# EAGLE schematic AAA_third_source_with charger (EAGLE 7.2.0)
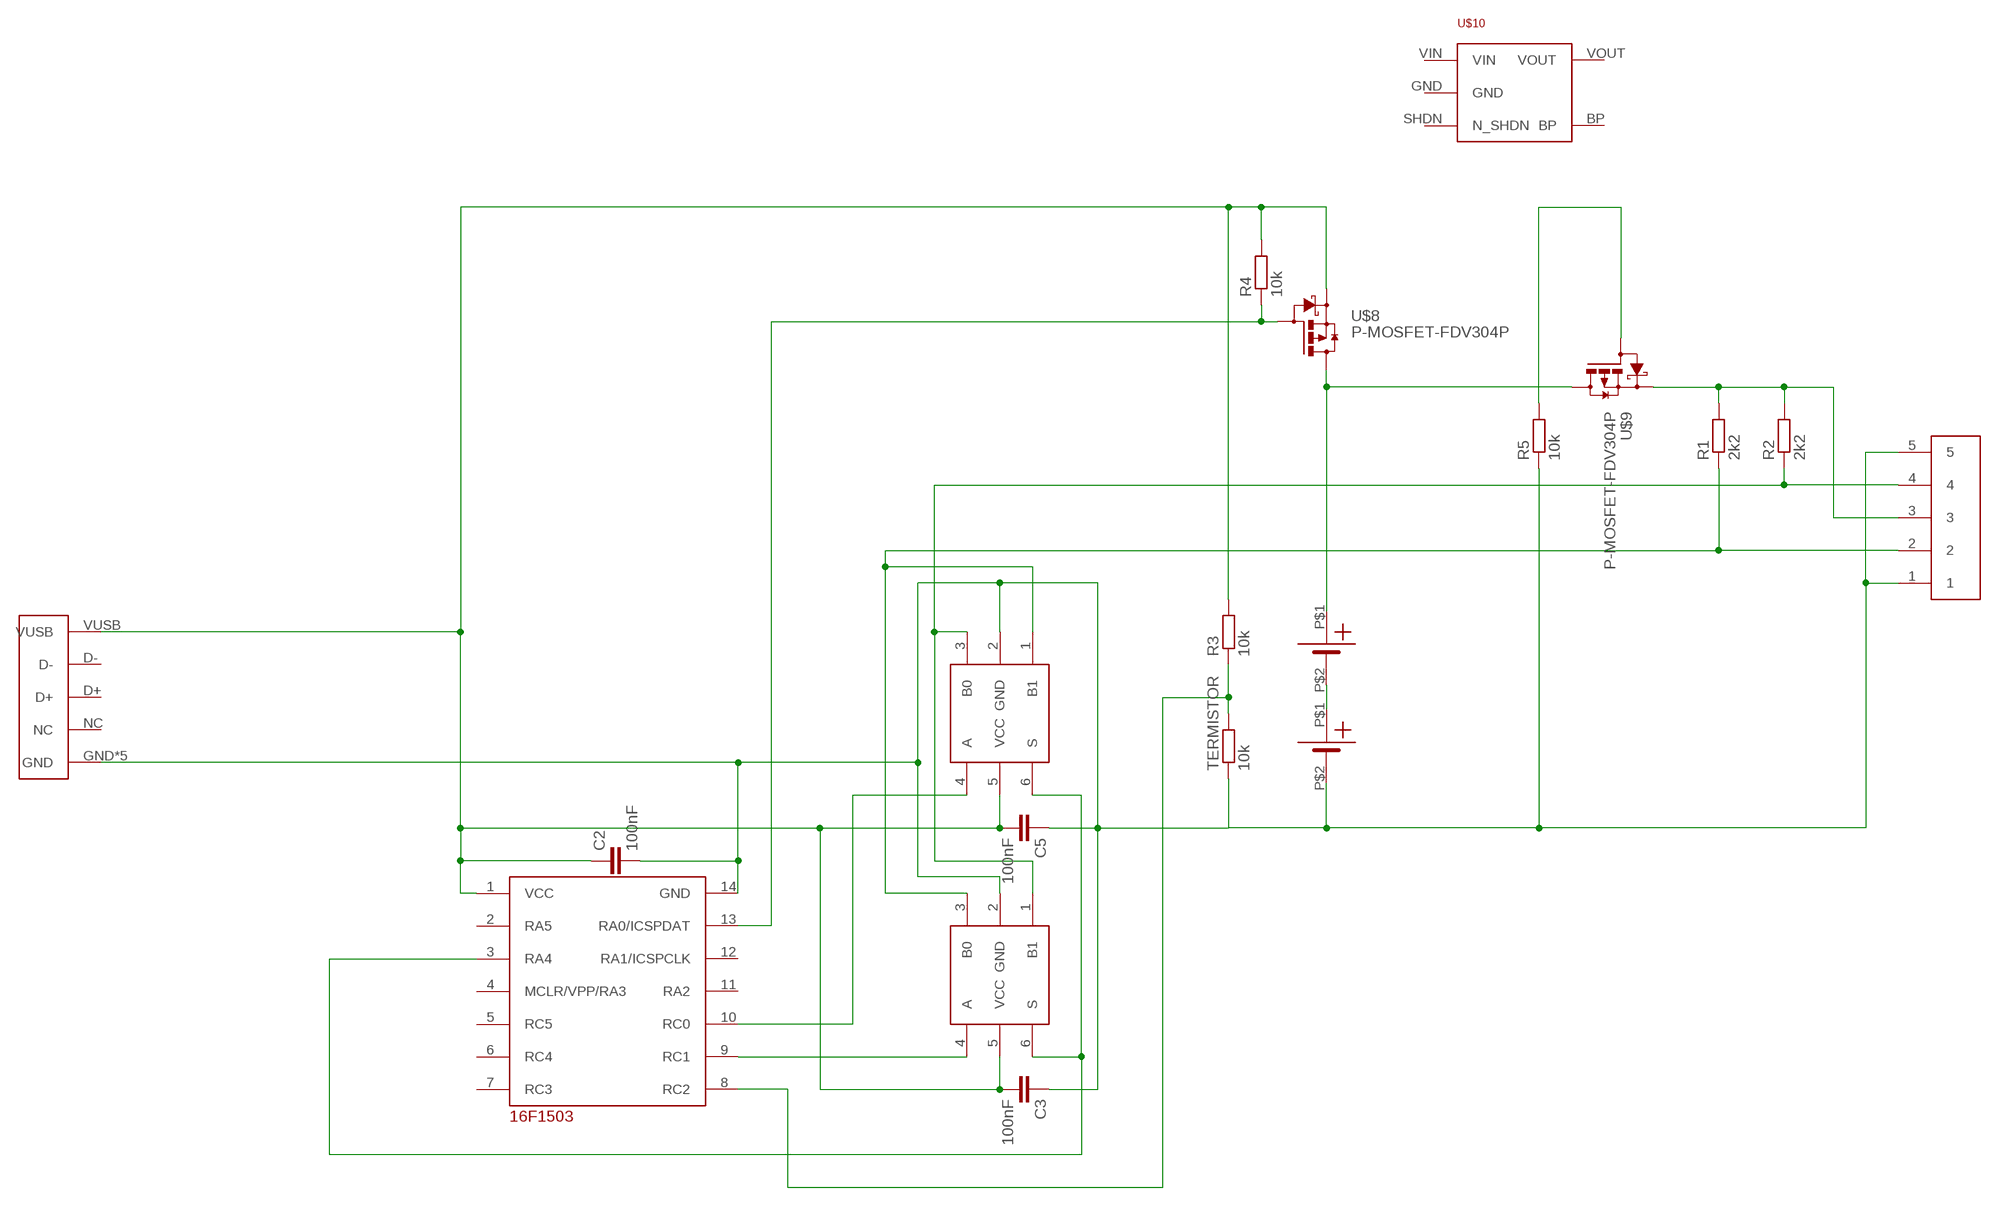
[diagram p0: schematic, sheet 1]

## Parts
C2  100nF  C-EUC0603  [C0603]
C3  100nF  C-EUC0603  [C0603]
C5  100nF  C-EUC0603  [C0603]
R1  2k2  R-EU_R0603  [R0603]
R2  2k2  R-EU_R0603  [R0603]
R3  10k  R-EU_R0603  [R0603]
R4  10k  R-EU_R0603  [R0603]
R5  10k  R-EU_R0603  [R0603]
TERMISTOR  10k  R-EU_R0603  [R0603]
U$1  16F103-TSSOP  [TSSOP14]
U$2  AAA_THIRD  [AAA_THIRD]
U$3  AAA_THIRD  [AAA_THIRD]
U$4  USBMICRO  [MICROUSB-MOLEX]
U$5  JUMPER5F-90  [JUMPER5F-90]
U$6  NC7SB3157P6X  [SC70-6L]
U$7  NC7SB3157P6X  [SC70-6L]
U$8  P-MOSFET-FDV304P  [SOT23]
U$9  P-MOSFET-FDV304P  [SOT23]
U$10  STABILISER_APE8865  [SOT32-5]

## Nets
GND: C2.2 C3.1 C5.1 R5.1 TERMISTOR.1 U$1.14(GND) U$4.GND U$4.P$1(GND) U$4.P$2(GND) U$4.P$3(GND) U$4.P$4(GND) U$5.1 U$5.5 U$6.2(GND) U$7.2(GND)
N$1: U$1.3(RA4) U$6.6(S) U$7.6(S)
N$2: U$2.P$2($2) U$3.P$1($1)
N$3: R3.1 TERMISTOR.2 U$1.8(RC2)
N$4: U$1.9(RC1) U$7.4(A)
N$5: R1.2 R2.2 U$5.3 U$9.S
N$6: R1.1 U$5.2 U$6.1(B1) U$7.3(B0)
N$7: U$1.10(RC0) U$6.4(A)
N$8: U$2.P$1($1) U$8.D U$9.D
N$9: R4.1 U$1.13(RA0/ICSPDAT) U$8.G
N$10: R2.1 U$5.4 U$6.3(B0) U$7.1(B1)
N$11: U$3.P$2($2)
N$12: R5.2 U$9.G
VCC: C2.1 C3.2 C5.2 R3.2 R4.2 U$1.1(VCC) U$4.VUSB U$6.5(VCC) U$7.5(VCC) U$8.S
Unconnected: U$1.2(RA5) U$1.4(MCLR/VPP/RA3) U$1.5(RC5) U$1.6(RC4) U$1.7(RC3) U$1.11(RA2) U$1.12(RA1/ICSPCLK) U$4.D+ U$4.D- U$4.NC U$10.BP U$10.GND U$10.SHDN(N_SHDN) U$10.VIN U$10.VOUT

## Library data of the parts
C2 C3 C5 = resistor:C-EU: CAPACITOR, European symbol
R1-R5 TERMISTOR = resistor:R-EU_: RESISTOR, European symbol
U$1 = !stavebnice03:16F103-TSSOP
U$2 U$3 = !stavebnice03:AAA_THIRD
U$4 = !stavebnice03:USBMICRO
U$5 = !stavebnice03:JUMPER5F-90
U$6 U$7 = !stavebnice03:NC7SB3157P6X
U$8 U$9 = !stavebnice03:P-MOSFET-FDV304P
U$10 = !stavebnice03:STABILISER_APE8865